# EAGLE schematic Aircopter (EAGLE 9.2.1)

## Sheet 1 of 5
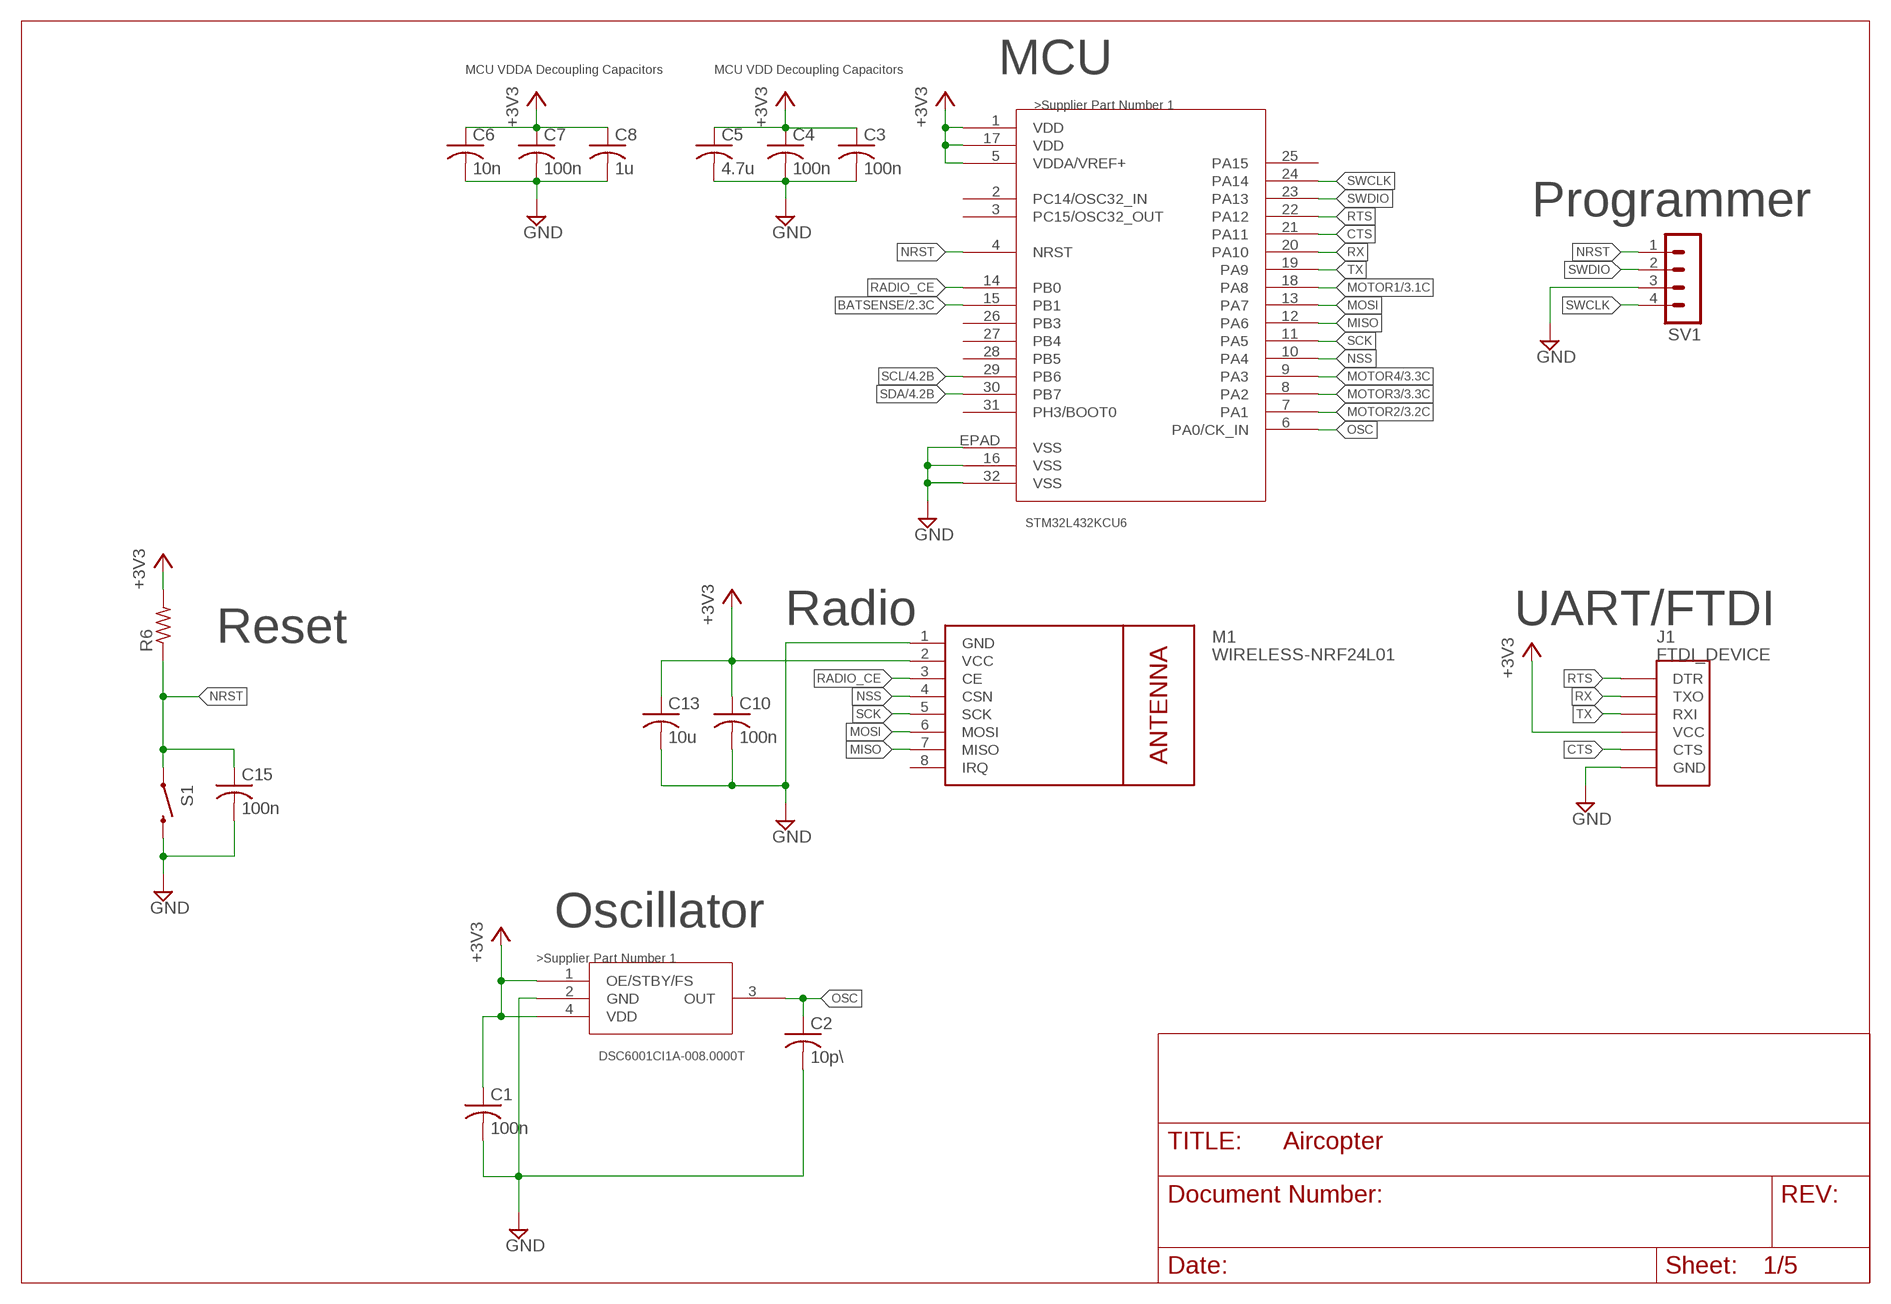
[diagram p0: schematic, sheet 1]

### Parts
*1  STM32L432KCU6  STM32L432KCU6STM32L432KCU6_QFN32_5X5MM  [QFN32_5X5MM]
*2  DSC6001CI1A-008.0000T  DSC6001CI1A-008.0000TDSC6001CI1A-008.0000T_VFLGA4  [VFLGA4]
C1  100n  C-USC0603K  [C0603K]
C2  10p\  C-USC0603K  [C0603K]
C3  100n  C-USC0603K  [C0603K]
C4  100n  C-USC0603K  [C0603K]
C5  4.7u  C-USC0603K  [C0603K]
C6  10n  C-USC0603K  [C0603K]
C7  100n  C-USC0603K  [C0603K]
C8  1u  C-USC0603K  [C0603K]
C10  100n  C-USC0603K  [C0603K]
C13  10u  C-USC0603K  [C0603K]
C15  100n  C-USC0603K  [C0603K]
J1  FTDI_DEVICE  [FTDI_DEVICE_SIDE]
M1  WIRELESS-NRF24L01  [WIRELESS-NRF24L01]
R6  R-US_R0603  [R0603]
S1  SWITCH-MOMENTARY-2SMD  [TACTILE-SWITCH-SMD]
SV1  MA04-1  [MA04-1]

### Nets
+3V3: *1.1(VDD) *1.5(VDDA/VREF+) *1.17(VDD) *2.1(OE/STBY/FS) *2.4(VDD) C1.1 C3.1 C4.1 C5.1 C6.1 C7.1 C8.1 C10.1 C13.1 J1.P$4(VCC) M1.2(VCC) R6.2 ; also sheet 2,3,4
BATSENSE: *1.15(PB1) ; also sheet 2
CTS: *1.21(PA11) J1.P$5(CTS)
GND: *1.16(VSS) *1.32(VSS) *1.EPAD(VSS) *2.2(GND) C1.2 C2.2 C6.2 C7.2 C8.2 C10.2 C13.2 C15.2 J1.P$6(GND) M1.1(GND) S1.3 SV1.3 ; also sheet 2,3,4
MISO: *1.12(PA6) M1.7(MISO)
MOSI: *1.13(PA7) M1.6(MOSI)
MOTOR1: *1.18(PA8) ; also sheet 3
MOTOR2: *1.7(PA1) ; also sheet 3
MOTOR3: *1.8(PA2) ; also sheet 3
MOTOR4: *1.9(PA3) ; also sheet 3
N$12: C3.2 C4.2 C5.2 ; supply symbol labelled GND
NRST: *1.4(NRST) C15.1 R6.1 S1.1 SV1.1
NSS: *1.10(PA4) M1.4(CSN)
OSC: *1.6(PA0/CK_IN) *2.3(OUT) C2.1
RADIO_CE: *1.14(PB0) M1.3(CE)
RTS: *1.22(PA12) J1.P$1(DTR)
RX: *1.20(PA10) J1.P$2(TXO)
SCK: *1.11(PA5) M1.5(SCK)
SCL: *1.29(PB6) ; also sheet 4
SDA: *1.30(PB7) ; also sheet 4
SWCLK: *1.24(PA14) SV1.4
SWDIO: *1.23(PA13) SV1.2
TX: *1.19(PA9) J1.P$3(RXI)
Unconnected: *1.2(PC14/OSC32_IN) *1.3(PC15/OSC32_OUT) *1.25(PA15) *1.26(PB3) *1.27(PB4) *1.28(PB5) *1.31(PH3/BOOT0) M1.8(IRQ)

### Notes on the sheet
- MCU VDDA Decoupling Capacitors | MCU VDD Decoupling Capacitors | MCU
- Programmer
- Radio | UART/FTDI
- Reset
- Oscillator

## Sheet 2 of 5
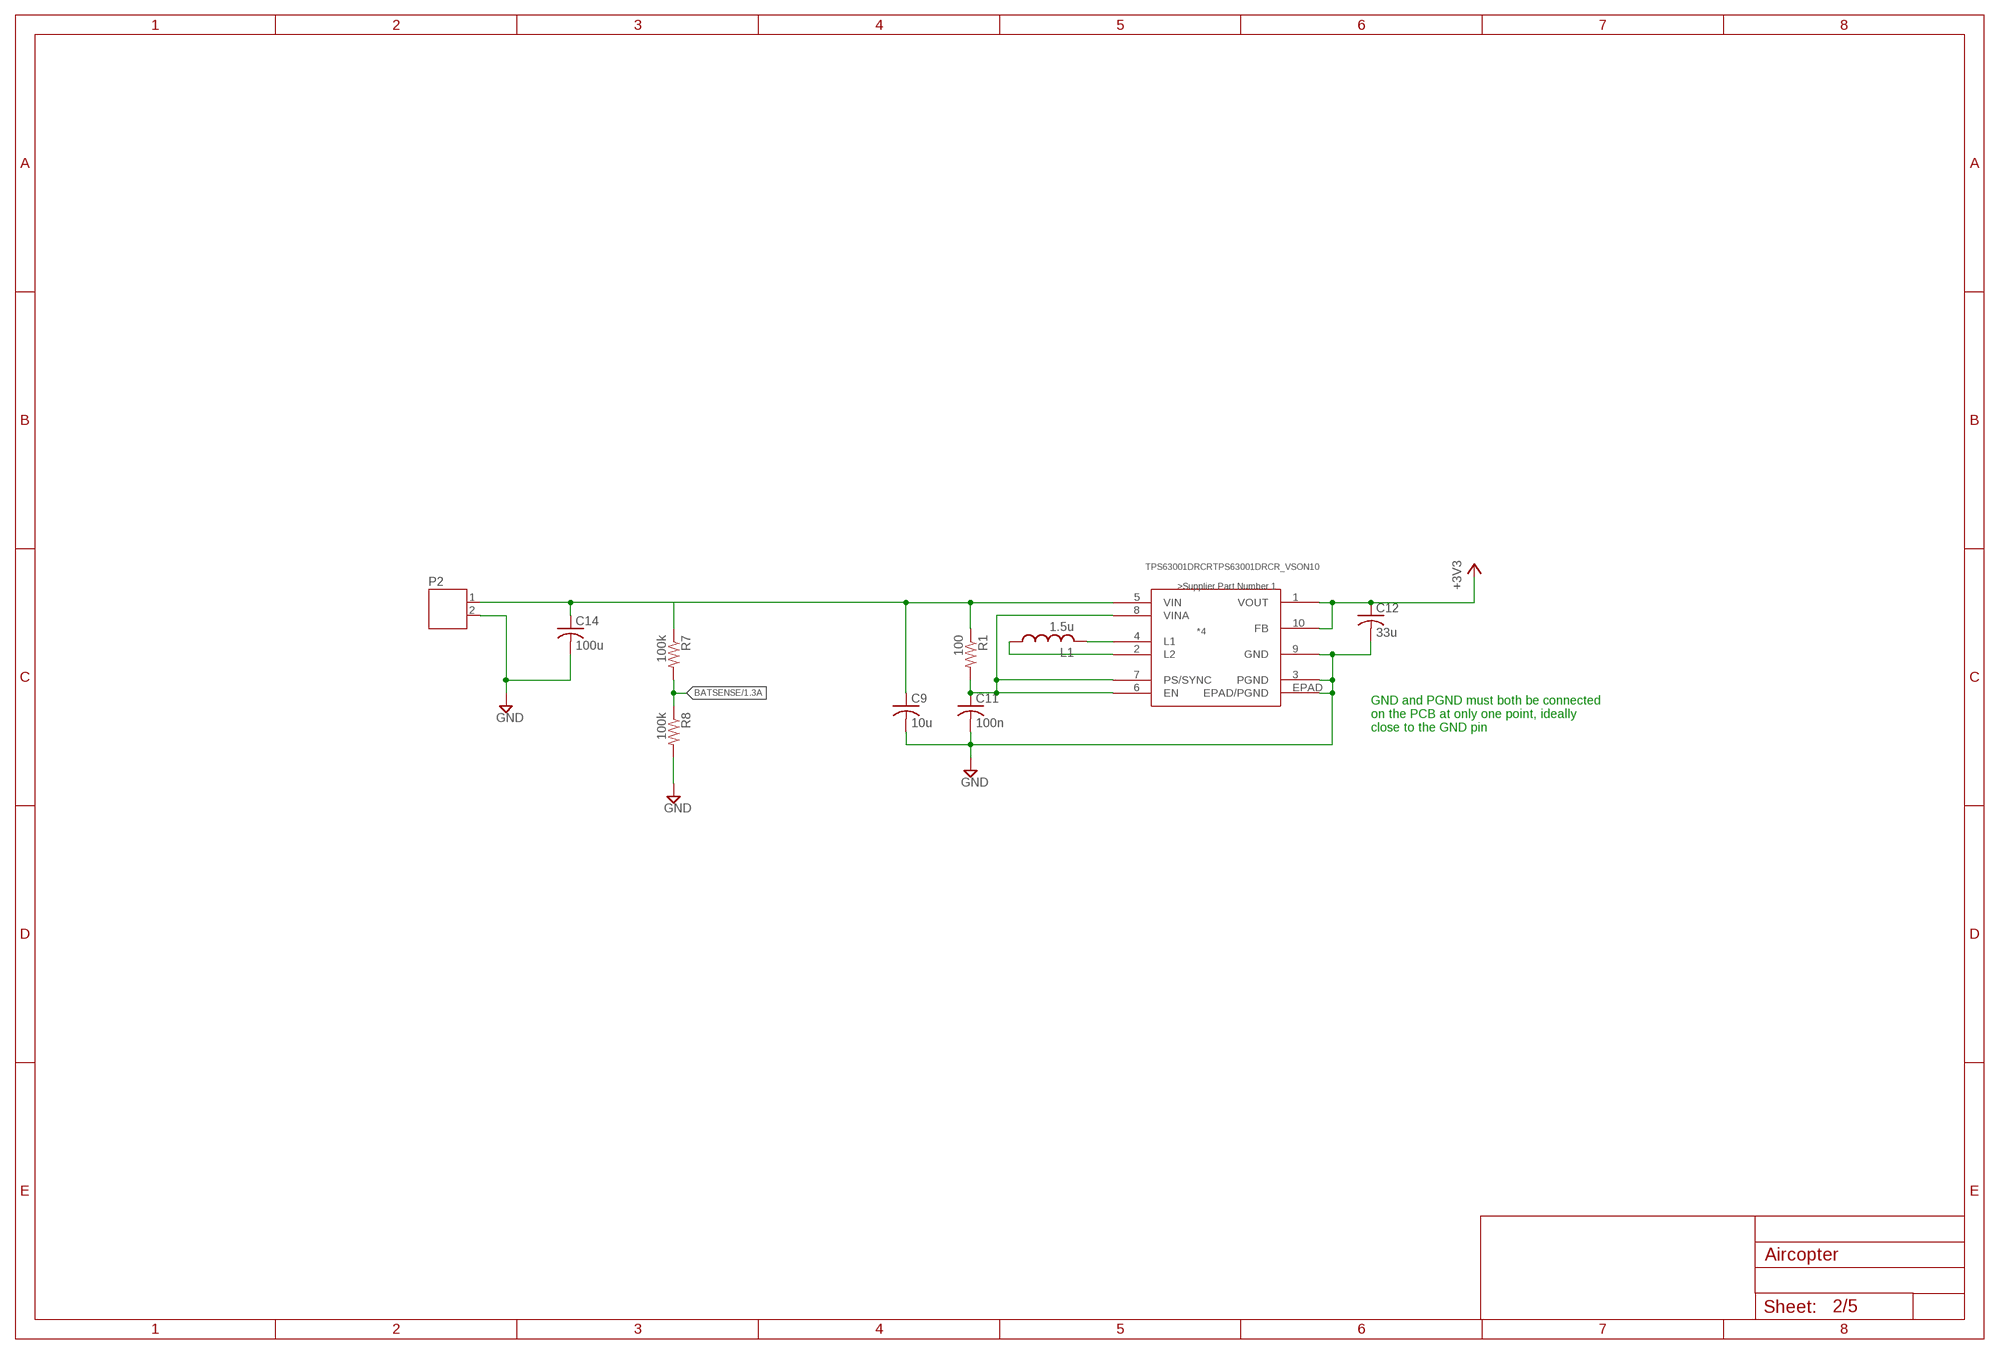
[diagram p1: schematic, sheet 2]

### Parts
*4  TPS63001DRCRTPS63001DRCR_VSON10  [VSON10]
C9  10u  C-US025-025X050  [C025-025X050]
C11  100n  C-US025-025X050  [C025-025X050]
C12  33u  C-US025-025X050  [C025-025X050]
C14  100u  C-US025-025X050  [C025-025X050]
L1  1.5u  L-US0204/5  [0204/5]
P2  JST-PH2  [JST-PH2]
R1  100  R-US_R0603  [R0603]
R7  100k  R-US_R0603  [R0603]
R8  100k  R-US_R0603  [R0603]

### Nets
+3V3: *4.1(VOUT) *4.10(FB) C12.1 ; also sheet 1,3,4
BATSENSE: R7.2 R8.1 ; also sheet 1
GND: *4.3(PGND) *4.9(GND) *4.EPAD(EPAD/PGND) C9.2 C11.2 C12.2 C14.2 P2.2 R8.2 ; also sheet 1,3,4
N$2: *4.4(L1) L1.2
N$4: *4.2(L2) L1.1
N$5: *4.6(EN) *4.7(PS/SYNC) *4.8(VINA) C11.1 R1.2
VIN: *4.5(VIN) C9.1 C14.1 P2.1 R1.1 R7.1

### Notes on the sheet
- GND and PGND must both be connected
  on the PCB at only one point, ideally
  close to the GND pin

## Sheet 3 of 5
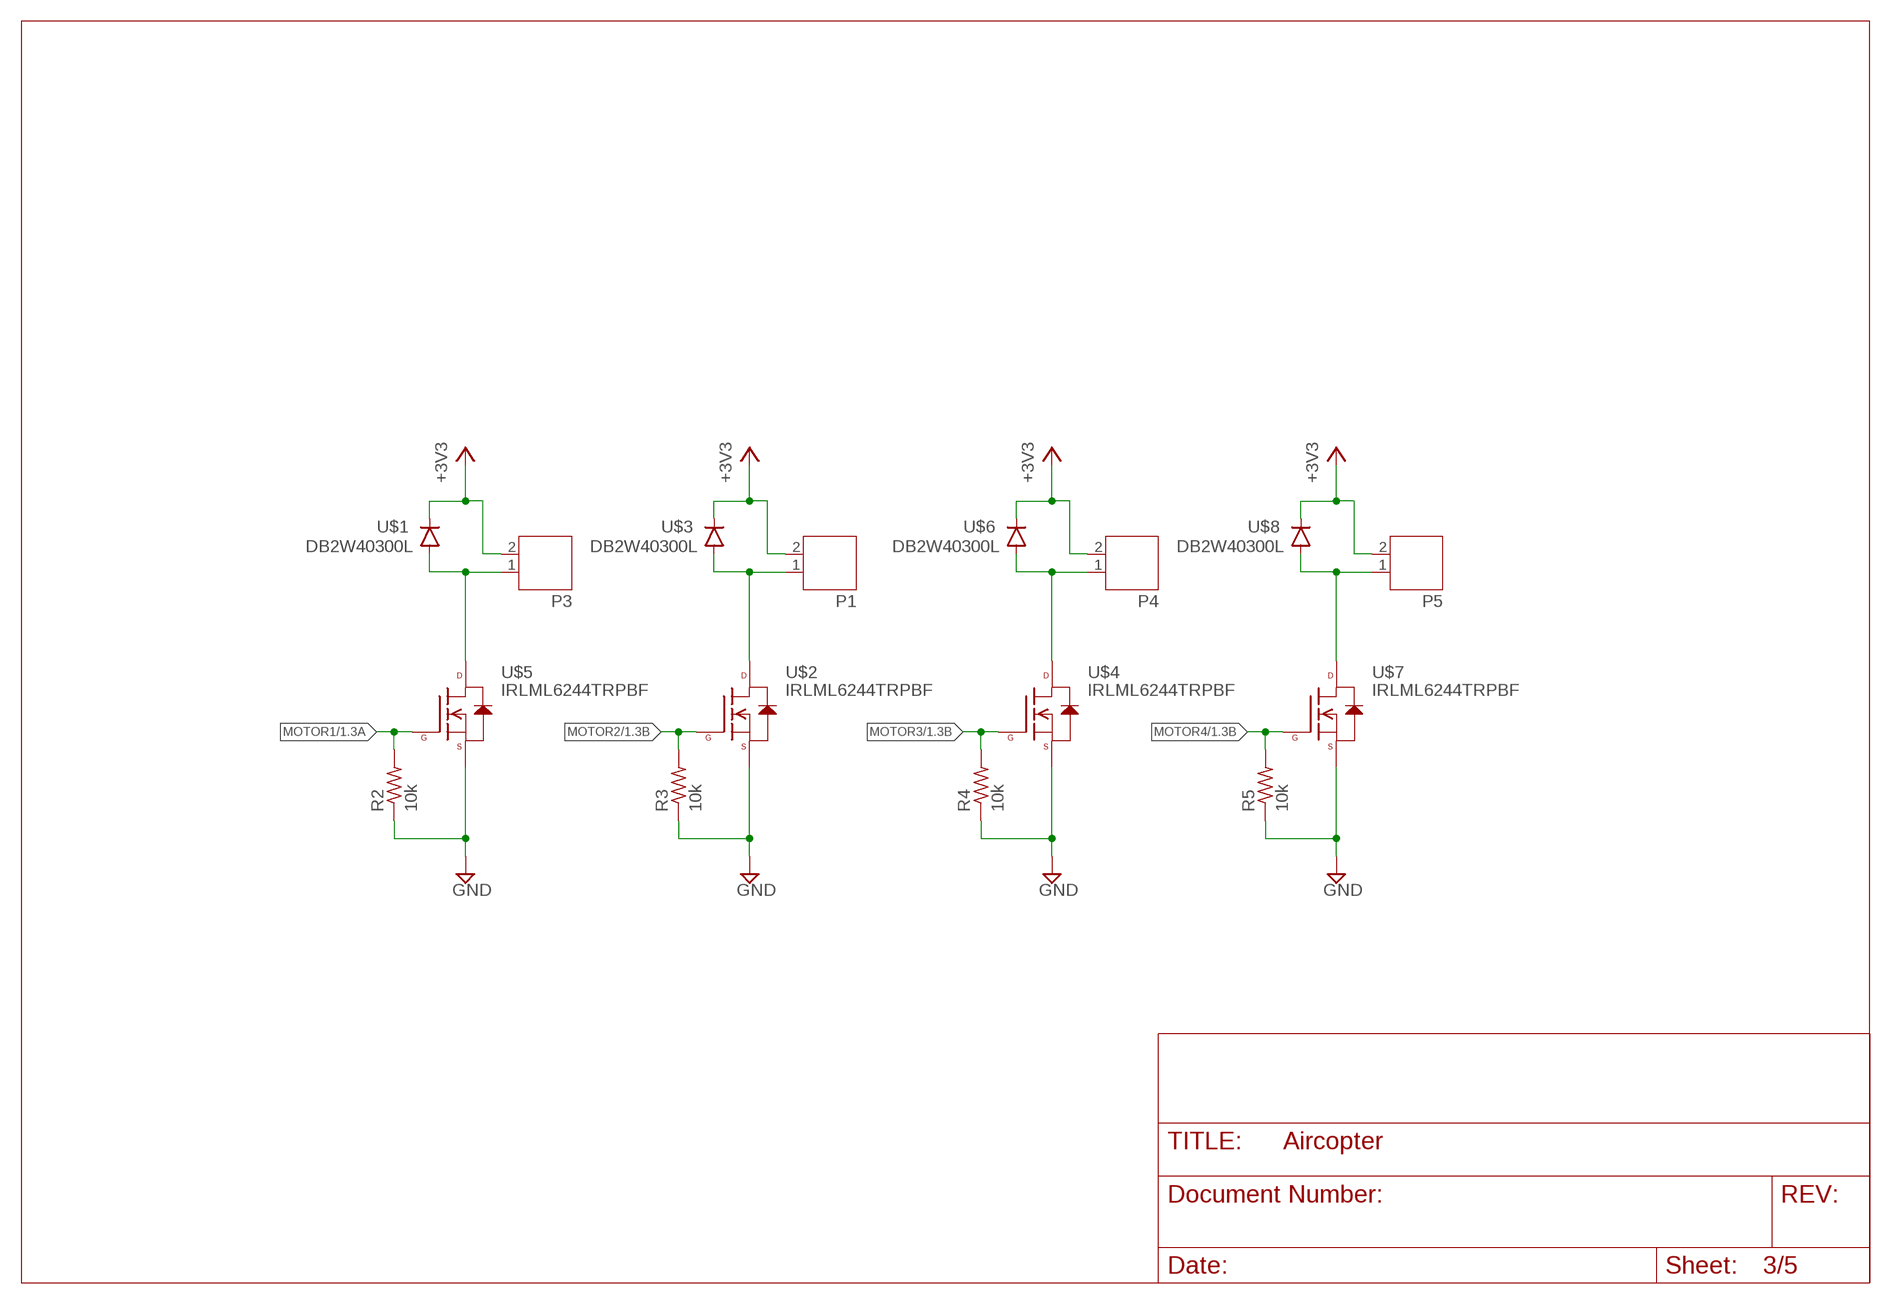
[diagram p2: schematic, sheet 3]

### Parts
P1  JST-PH2  [JST-PH2]
P3  JST-PH2  [JST-PH2]
P4  JST-PH2  [JST-PH2]
P5  JST-PH2  [JST-PH2]
R2  10k  R-US_R0603  [R0603]
R3  10k  R-US_R0603  [R0603]
R4  10k  R-US_R0603  [R0603]
R5  10k  R-US_R0603  [R0603]
U$1  DB2W40300L  [MINI2-F3-B]
U$2  IRLML6244TRPBF  N-CHANNEL-MOSFET-IRLML6244TRPBF  [SOT23-3]
U$3  DB2W40300L  [MINI2-F3-B]
U$4  IRLML6244TRPBF  N-CHANNEL-MOSFET-IRLML6244TRPBF  [SOT23-3]
U$5  IRLML6244TRPBF  N-CHANNEL-MOSFET-IRLML6244TRPBF  [SOT23-3]
U$6  DB2W40300L  [MINI2-F3-B]
U$7  IRLML6244TRPBF  N-CHANNEL-MOSFET-IRLML6244TRPBF  [SOT23-3]
U$8  DB2W40300L  [MINI2-F3-B]

### Nets
+3V3: P1.2 P3.2 P4.2 P5.2 U$1.NEG(GPIN) U$3.NEG(GPIN) U$6.NEG(GPIN) U$8.NEG(GPIN) ; also sheet 1,2,4
GND: R2.1 R3.1 R4.1 R5.1 U$2.2(S) U$4.2(S) U$5.2(S) U$7.2(S) ; also sheet 1,2,4
MOTOR1: R2.2 U$5.1(G) ; also sheet 1
MOTOR2: R3.2 U$2.1(G) ; also sheet 1
MOTOR3: R4.2 U$4.1(G) ; also sheet 1
MOTOR4: R5.2 U$7.1(G) ; also sheet 1
N$1: P3.1 U$1.POS(PPIN) U$5.3(D)
N$3: P1.1 U$2.3(D) U$3.POS(PPIN)
N$6: P4.1 U$4.3(D) U$6.POS(PPIN)
N$7: P5.1 U$7.3(D) U$8.POS(PPIN)

## Sheet 4 of 5
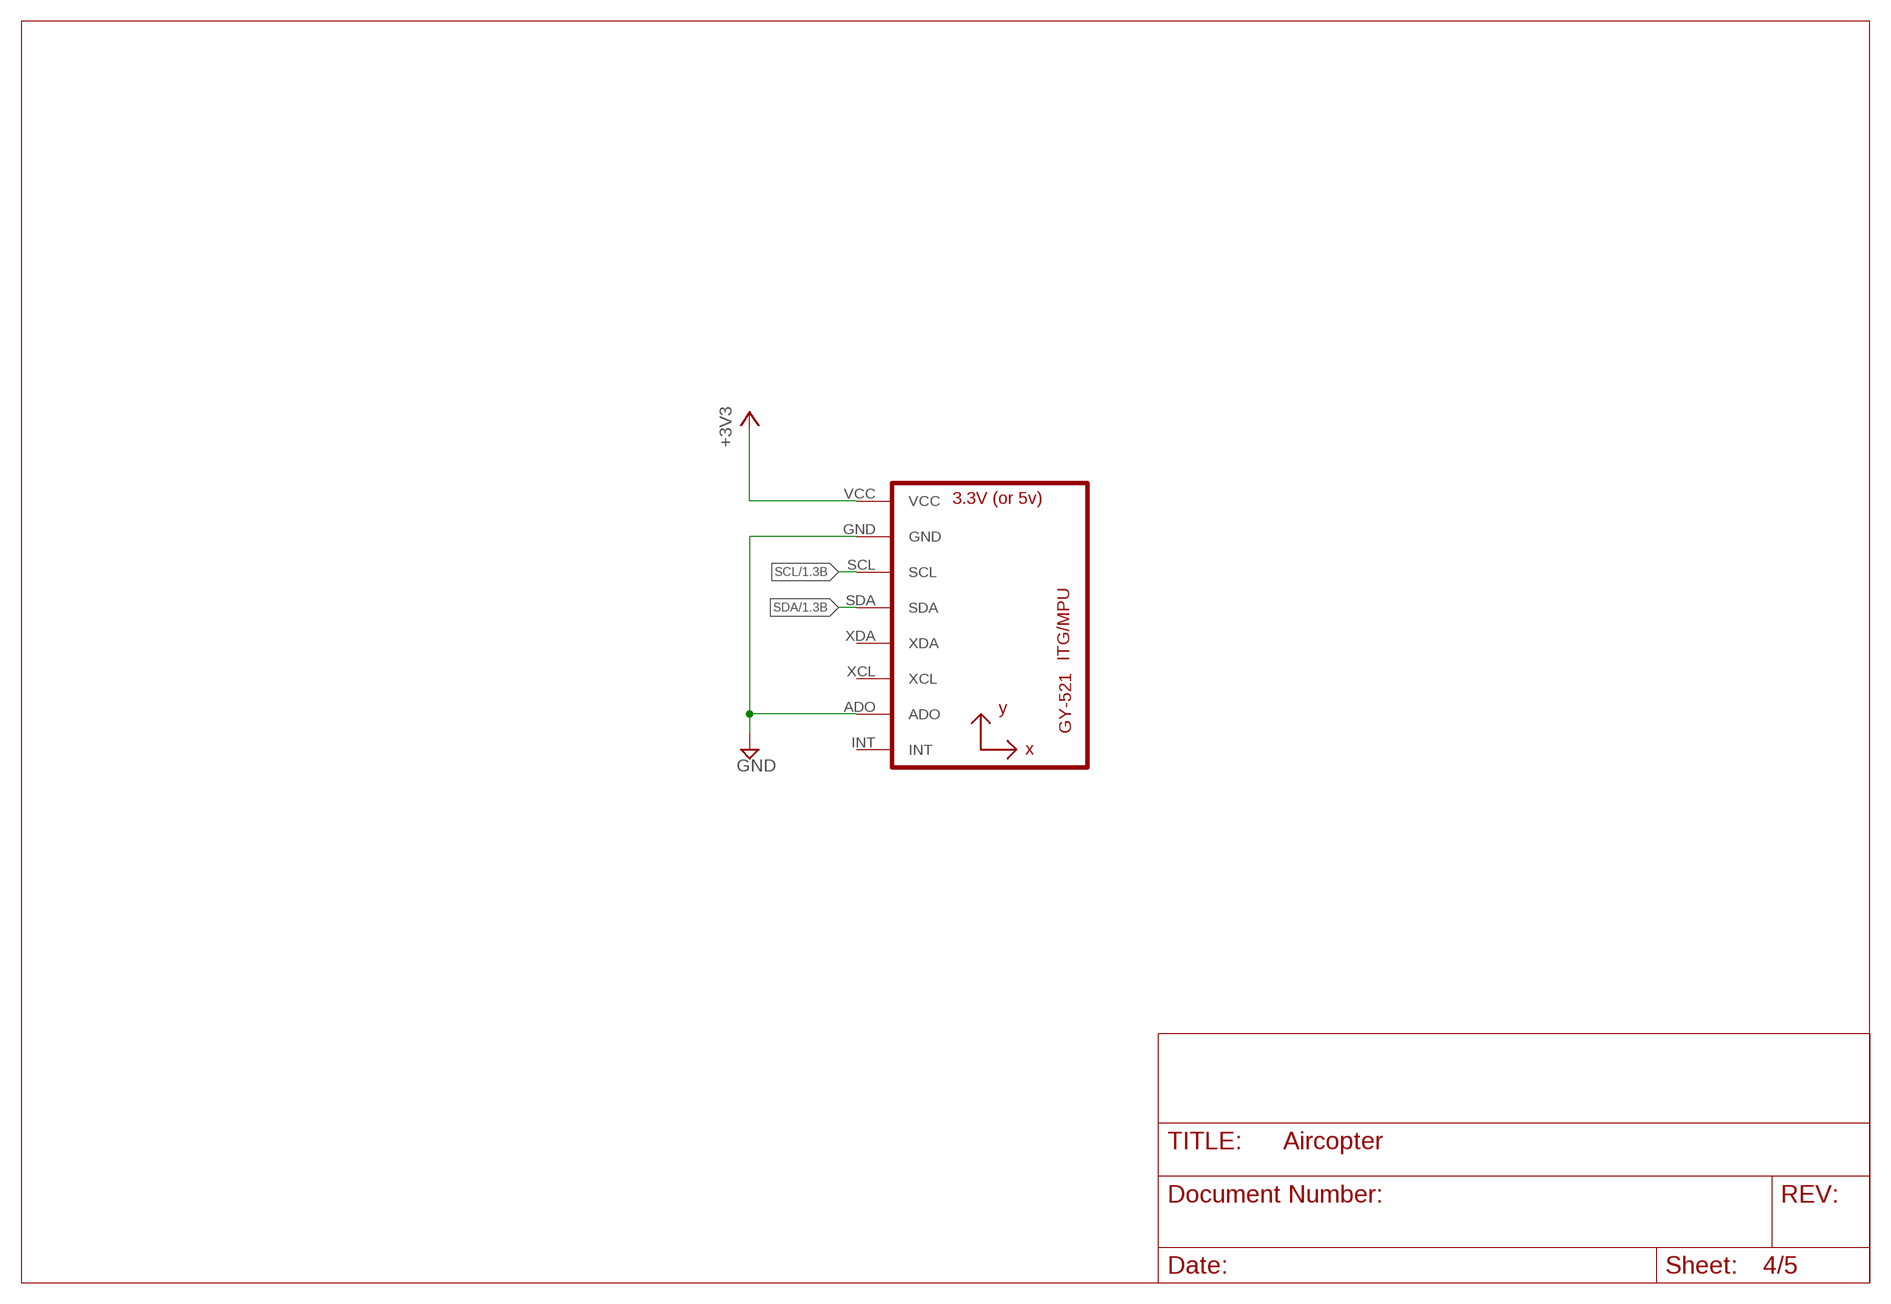
[diagram p3: schematic, sheet 4]

### Parts
U1  GY-521MPU6050  [GY-521]

### Nets
+3V3: U1.VCC ; also sheet 1,2,3
GND: U1.ADO U1.GND ; also sheet 1,2,3
SCL: U1.SCL ; also sheet 1
SDA: U1.SDA ; also sheet 1
Unconnected: U1.INT U1.XCL U1.XDA

## Sheet 5 of 5

## Library data of the parts
*1 = Aircopter:STM32L432KCU6: 16/32-BITS MICROS; DESCRIPTION: 16/32-BITS MICROS; LEAD_FREE: Lead Free; MANUFACTURER: STMicroelectronics; MANUFACTURER_PART_NUMBER: STM32L432KCU6; NUMBER_OF_PINS: 32; STOCK_1: 6394; SUPPLIER_1: Mouser; SUPPLIER_PART_NUMBER_1: 511-STM32L432KCU6
*2 = Aircopter:DSC6001CI1A-008.0000T: No description set; MANUFACTURER: Microchip; MANUFACTURER_PART_NUMBER: DSC6001CI1A-008.0000T; STOCK_1: 1311; SUPPLIER_1: Digi-Key; SUPPLIER_PART_NUMBER_1: DSC6001CI1A-008.0000TDKR-ND
*4 = Aircopter:TPS63001DRCR: IC REG BUCK BST 3.3V 1.6A 10SON; COMPONENTLINK1DESCRIPTION: http://www.ti.com/lit/ds/symlink/tps63001.pdf; COMPONENTLINK1URL: http://www.ti.com/lit/ds/symlink/tps63001.pdf; COMPONENTLINK2DESCRIPTION: http://www.farnell.com/datasheets/1854797.pdf; COMPONENTLINK2URL: http://www.farnell.com/datasheets/1854797.pdf; COMPONENTLINK4DESCRIPTION: http://focus.ti.com/lit/ds/symlink/tps63001.pdf; COMPONENTLINK4URL: http://focus.ti.com/lit/ds/symlink/tps63001.pdf; COMPONENTLINK7DESCRIPTION: http://www.farnell.com/datasheets/2018926.pdf; COMPONENTLINK7URL: http://www.farnell.com/datasheets/2018926.pdf; COMPONENTLINK8DESCRIPTION: http://datasheet.iiic.cc/texas_instruments/TPS63001DRCR.pdf; COMPONENTLINK8URL: http://datasheet.iiic.cc/texas_instruments/TPS63001DRCR.pdf; COMPONENTLINK9DESCRIPTION: http://www.produktinfo.conrad.com/datenblaetter/1000000-1099999/001014938-da-01-en-IC_REG_BUCK_BST_TPS63001DRCR_VSON_10_TID.pdf; COMPONENTLINK9URL: http://www.produktinfo.conrad.com/datenblaetter/1000000-1099999/001014938-da-01-en-IC_REG_BUCK_BST_TPS63001DRCR_VSON_10_TID.pdf; CONTACT_PLATING: Gold; DESCRIPTION: IC REG BUCK BST 3.3V 1.6A 10SON; EFFICIENCY: 96%; LEAD_FREE: Lead Free; MANUFACTURER: Texas Instruments; MANUFACTURER_PART_NUMBER: TPS63001DRCR; MAX_INPUT_VOLTAGE: 5.5V; MAX_OPERATING_TEMPERATURE: 85�C; MAX_OUTPUT_CURRENT: 1.2A; MAX_OUTPUT_VOLTAGE: 3.3V; MIN_INPUT_VOLTAGE: 1.8V; MIN_OPERATING_TEMPERATURE: -40�C; MIN_OUTPUT_VOLTAGE: 3.3V; NOMINAL_OUTPUT_VOLTAGE: 3.3V; NUMBER_OF_OUTPUTS: 1; NUMBER_OF_PINS: 10; OPERATING_SUPPLY_VOLTAGE: 5.5V; OUTPUT_CURRENT: 1.2A; OUTPUT_TYPE: Fixed; OUTPUT_VOLTAGE: 3.3V; PACKAGE_QUANTITY: 1; PACKAGING: Tape and Reel; QUIESCENT_CURRENT: 30uA; RADIATION_HARDENING: No; REACH_SVHC: No SVHC; STOCK_1: 260; SUPPLIER_1: Digi-Key; SUPPLIER_PART_NUMBER_1: 296-19643-6-ND; SWITCHING_FREQUENCY: 1.5MHz; SYNCHRONOUS_RECTIFIER: Yes; TOPOLOGY: Buck-Boost; WEIGHT: 0.000921oz
C1-C15 = rcl:C-US: CAPACITOR, American symbol; SPICEPREFIX: C
J1 = AP_quad:FTDI_DEVICE: Connector which mates to FTDI basic or FTDI cable.
L1 = rcl:L-US: INDUCTOR, American symbol; SPICEPREFIX: L
M1 = AP_quad:WIRELESS-NRF24L01: 2.4 GHz Wireless Module based on NRF24L01 chip
P1-P5 = jst-ph:JST-PH2
R1 R7 R8 = rcl:R-US_: RESISTOR, American symbol; SPICEPREFIX: R
R2-R6 = resistor:R-US_: RESISTOR, American symbol
S1 = AP_quad:SWITCH-MOMENTARY-2: Various NO switches- pushbuttons, reed, etc; PROD_ID: SWCH-08247
SV1 = con-lstb:MA04-1: PIN HEADER; OC_FARNELL: unknown; OC_NEWARK: unknown
U1 = AP_quad:GY-521
U$1 U$3 U$6 U$8 = AP_quad:DB2W40300L
U$2 U$4 U$5 U$7 = AP_quad:N-CHANNEL-MOSFET: N-Channel MOSFET Mode Field Effect Transistor; DATASHEET: http://www.mouser.com/ds/2/196/irlml6244pbf-936666.pdf; MOUSER: 942-IRLML6244TRPBF; URL: http://www.mouser.com/Search/ProductDetail.aspx?R=IRLML6244TRPBFvirtualkey57370000virtualkey942-IRLML6244TRPBF